# Altium schematic sheet MCU_CAN.SchDoc
size B; SheetNumber: 8; SheetTotal: 8
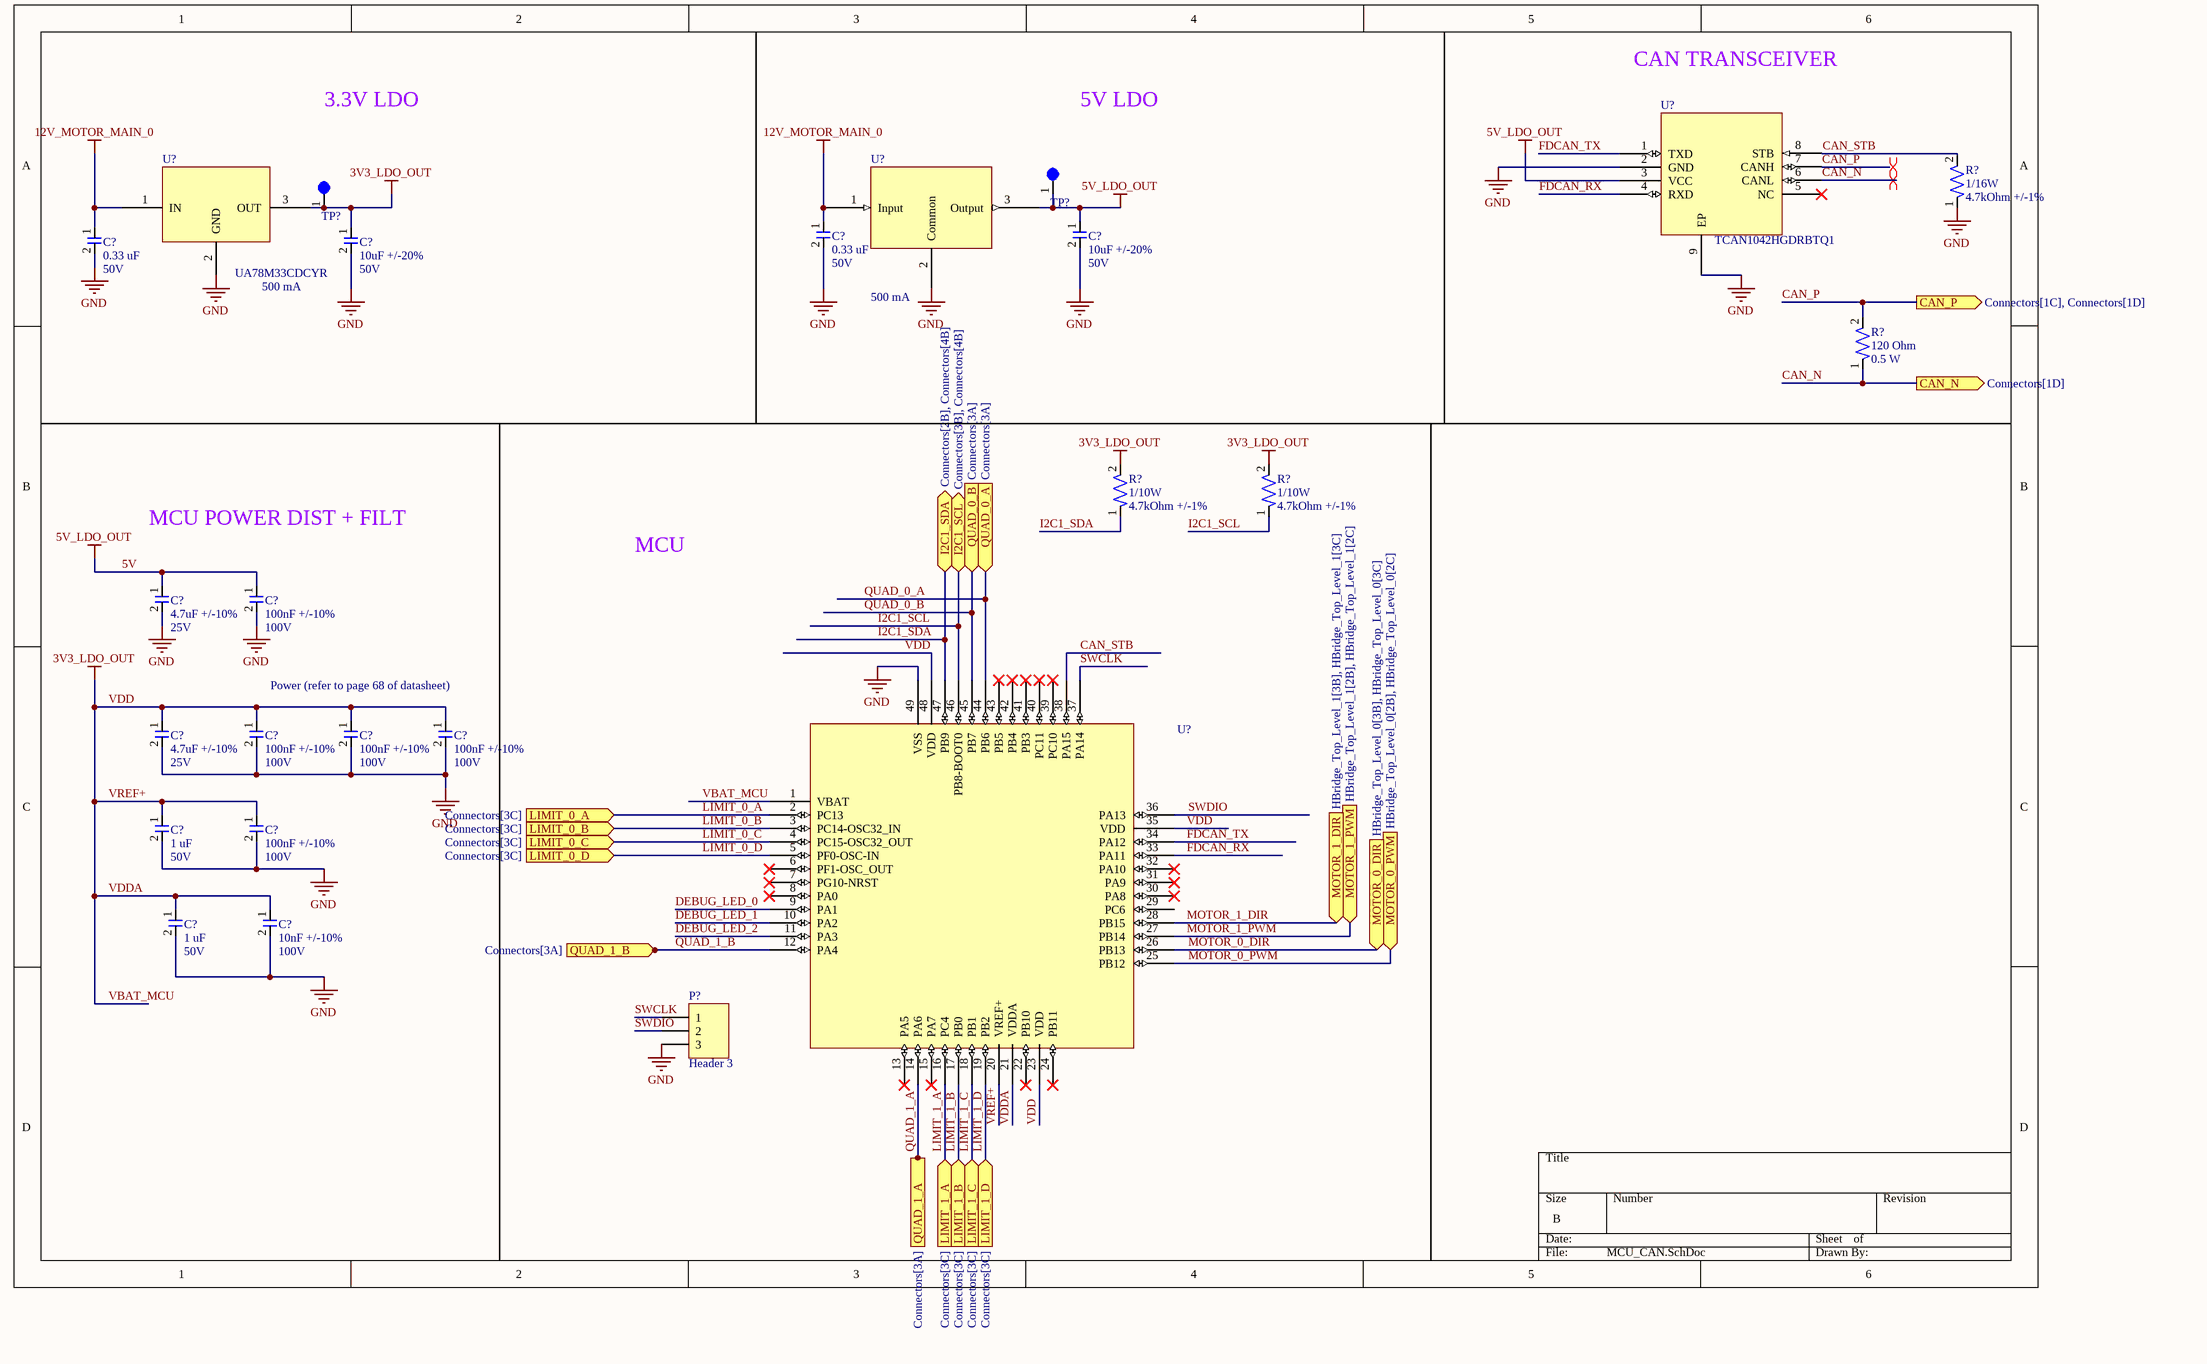
[diagram p0: MCU_CAN.SchDoc]

## Parts
(Parts that share a designator on the sheet are numbered #1, #2 ... from top to bottom, then left to right.)
C?#1  Capacitance: 0.33 uF  Voltage: 50V  [CAP-0603]  (hidden comment: CGA3E3X7R1H334K080AB)
C?#2  Capacitance: 10uF +/-20%  Voltage Rating: 50V  [CAP-1206]  (hidden comment: CL31B106KBHNNNE)
C?#3  Capacitance: 0.33 uF  Voltage: 50V  [CAP-0603]  (hidden comment: CGA3E3X7R1H334K080AB)
C?#4  Capacitance: 10uF +/-20%  Voltage Rating: 50V  [CAP-1206]  (hidden comment: CL31B106KBHNNNE)
C?#5  Capacitance: 4.7uF +/-10%  Voltage Rating: 25V  [CAP-0603]  (hidden comment: TMK107BBJ475KA-T)
C?#6  Capacitance: 100nF +/-10%  Voltage Rating: 100V  [CAP-0603]  (hidden comment: CC0603KRX7R0BB104)
C?#7  Capacitance: 4.7uF +/-10%  Voltage Rating: 25V  [CAP-0603]  (hidden comment: TMK107BBJ475KA-T)
C?#8  Capacitance: 100nF +/-10%  Voltage Rating: 100V  [CAP-0603]  (hidden comment: CC0603KRX7R0BB104)
C?#9  Capacitance: 100nF +/-10%  Voltage Rating: 100V  [CAP-0603]  (hidden comment: CC0603KRX7R0BB104)
C?#10  Capacitance: 100nF +/-10%  Voltage Rating: 100V  [CAP-0603]  (hidden comment: CC0603KRX7R0BB104)
C?#11  Capacitance: 1 uF  Voltage: 50V  [CAP-0603]  (hidden comment: UMK107AB7105KA-T)
C?#12  Capacitance: 100nF +/-10%  Voltage Rating: 100V  [CAP-0603]  (hidden comment: CC0603KRX7R0BB104)
C?#13  Capacitance: 1 uF  Voltage: 50V  [CAP-0603]  (hidden comment: UMK107AB7105KA-T)
C?#14  Capacitance: 10nF +/-10%  Voltage Rating: 100V  [CAP-0402]  (hidden comment: CC0402KRX7R0BB103)
P?  Header 3  [HDR1X3]
R?#1  Power Rating: 1/16W  Resistance: 4.7kOhm +/-1%  [RES-0402]  (hidden comment: RC0402FR-074K7P)
R?#2  Resistance: 120 Ohm  Power: 0.5 W  [RES-1206]  (hidden comment: CRGH1206F120R)
R?#3  Power Rating: 1/10W  Resistance: 4.7kOhm +/-1%  [RES-0603]  (hidden comment: AF0603FR-074K7L)
R?#4  Power Rating: 1/10W  Resistance: 4.7kOhm +/-1%  [RES-0603]  (hidden comment: AF0603FR-074K7L)
TP?#1  5003  [TEST-POINT-0001]  (value not drawn)
TP?#2  5003  [TEST-POINT-0001]  (value not drawn)
U?#1  TCAN1042HGDRBTQ1  [IC-8-VSON]
U?#2  UA78M33CDCYR  Current: 500 mA  [IC-SOT-223-4]
U?#3  Current: 500 mA  [IC-SOT-223-4]  (hidden comment: UA78M05IDCYR)
U?#4  STM32G431CBU6  [MCU-UFQFPN48]  (value not drawn)

## Ports
CAN_N (out, see Connectors[1D]), CAN_P (out, see Connectors[1C], Connectors[1D]), I2C1_SCL (bidir, see Connectors[3B], Connectors[4B]), I2C1_SDA (bidir, see Connectors[2B], Connectors[4B]), LIMIT_0_A (in, see Connectors[3C]), LIMIT_0_B (in, see Connectors[3C]), LIMIT_0_C (in, see Connectors[3C]), LIMIT_0_D (in, see Connectors[3C]), LIMIT_1_A (in, see Connectors[3C]), LIMIT_1_B (in, see Connectors[3C]), LIMIT_1_C (in, see Connectors[3C]), LIMIT_1_D (in, see Connectors[3C]), MOTOR_0_DIR (in, see HBridge_Top_Level_0[3B], HBridge_Top_Level_0[3C]), MOTOR_0_PWM (in, see HBridge_Top_Level_0[2B], HBridge_Top_Level_0[2C]), MOTOR_1_DIR (in, see HBridge_Top_Level_1[3B], HBridge_Top_Level_1[3C]), MOTOR_1_PWM (in, see HBridge_Top_Level_1[2B], HBridge_Top_Level_1[2C]), QUAD_0_A (in, see Connectors[3A]), QUAD_0_B (in, see Connectors[3A]), QUAD_1_A (in, see Connectors[3A]), QUAD_1_B (in, see Connectors[3A])

## Nets
5V: C?#2.1 C?#5.1 C?#6.1 TP?#1.1 U?#1.3(VCC) U?#3.3(Output)  [also labelled 5V_LDO_OUT]
12V_MOTOR_MAIN_0: C?#1.1 C?#3.1 U?#2.1(IN) U?#3.1(Input)
GND: C?#1.2 C?#2.2 C?#3.2 C?#4.2 C?#5.2 C?#6.2 C?#7.2 C?#8.2 C?#9.2 C?#10.2 C?#11.2 C?#12.2 C?#13.2 C?#14.2 P?.3 R?#1.1 U?#1.2(GND) U?#1.9(EP) U?#2.2(GND) U?#3.2(Common) U?#4.49(VSS)
VBAT_MCU: C?#4.1 C?#7.1 C?#8.1 C?#9.1 C?#10.1 C?#11.1 C?#12.1 C?#13.1 C?#14.1 R?#3.2 R?#4.2 TP?#2.1 U?#2.3(OUT) U?#4.1(VBAT) U?#4.20(VREF+) U?#4.21(VDDA) U?#4.23(VDD) U?#4.35(VDD) U?#4.48(VDD)  [also labelled 3V3_LDO_OUT, VDD, VDDA, VREF+]
CAN_N: R?#2.1 U?#1.6(CANL) ; port CAN_N
CAN_P: R?#2.2 U?#1.7(CANH) ; port CAN_P
CAN_STB: R?#1.2 U?#1.8(STB) U?#4.38(PA15)
DEBUG_LED_0: U?#4.9(PA1)
DEBUG_LED_1: U?#4.10(PA2)
DEBUG_LED_2: U?#4.11(PA3)
FDCAN_RX: U?#1.4(RXD) U?#4.33(PA11)
FDCAN_TX: U?#1.1(TXD) U?#4.34(PA12)
I2C1_SCL: R?#4.1 U?#4.46(PB8-BOOT0) ; port I2C1_SCL
I2C1_SDA: R?#3.1 U?#4.47(PB9) ; port I2C1_SDA
LIMIT_0_A: U?#4.2(PC13) ; port LIMIT_0_A
LIMIT_0_B: U?#4.3(PC14-OSC32_IN) ; port LIMIT_0_B
LIMIT_0_C: U?#4.4(PC15-OSC32_OUT) ; port LIMIT_0_C
LIMIT_0_D: U?#4.5(PF0-OSC-IN) ; port LIMIT_0_D
LIMIT_1_A: U?#4.16(PC4) ; port LIMIT_1_A
LIMIT_1_B: U?#4.17(PB0) ; port LIMIT_1_B
LIMIT_1_C: U?#4.18(PB1) ; port LIMIT_1_C
LIMIT_1_D: U?#4.19(PB2) ; port LIMIT_1_D
MOTOR_0_DIR: U?#4.26(PB13) ; port MOTOR_0_DIR
MOTOR_0_PWM: U?#4.25(PB12) ; port MOTOR_0_PWM
MOTOR_1_DIR: U?#4.28(PB15) ; port MOTOR_1_DIR
MOTOR_1_PWM: U?#4.27(PB14) ; port MOTOR_1_PWM
QUAD_0_A: U?#4.44(PB6) ; port QUAD_0_A
QUAD_0_B: U?#4.45(PB7) ; port QUAD_0_B
QUAD_1_A: U?#4.14(PA6) ; port QUAD_1_A
QUAD_1_B: U?#4.12(PA4) ; port QUAD_1_B
SWCLK: P?.1 U?#4.37(PA14)
SWDIO: P?.2 U?#4.36(PA13)

Not connected (* = marked no-connect by the designer): U?#1 5(NC)*; U?#4 6(PF1-OSC_OUT)* 7(PG10-NRST)* 8(PA0)* 13(PA5)* 15(PA7)* 22(PB10)* 24(PB11)* 29(PC6) 30(PA8)* 31(PA9)* 32(PA10)* 39(PC10)* 40(PC11)* 41(PB3)* 42(PB4)* 43(PB5)*

## Layout directives
differential pair: CAN_N, CAN_P

## Notes on the sheet
- CAN TRANSCEIVER
- 3.3V LDO
- 5V LDO
- MCU POWER DIST + FILT
- MCU
- (near C?#9) Power (refer to page 68 of datasheet)

## Library data of the parts
C?#1 C?#3 = CAP-0.33uF-0001: 0.33 µF ±10% 50V Ceramic Capacitor X7R 0603 (1608 Metric); Manufacturer: TDK Corporation; Tolerance: +/- 10%; Manufacturer Part Number: CGA3E3X7R1H334K080AB; Temperature Coefficient: X7R
C?#2 C?#4 = CAP-10U-0001: 10 µF ±10% 50V Ceramic Capacitor X7R 1206 (3216 Metric); Manufacturer: Samsung Electro-Mechanics; Assembled?: no; Manufacturer Part Number: CL31B106KBHNNNE; Temperature Coefficient: X7R; Package Size: 1206
C?#5 C?#7 = CAP-4.7U-0001: 4.7 µF ±10% 25V Ceramic Capacitor X5R 0603 (1608 Metric); Manufacturer: Taiyo Yuden; Assembled?: no; Manufacturer Part Number: TMK107BBJ475KA-T; Temperature Coefficient: X5R; Package Size: 0603
C?#6 C?#8-C?#10 C?#12 = CAP-100N-0001: CAP CER 0.1UF 100V X7R 0603; Manufacturer: YAGEO; Assembled?: no; Manufacturer Part Number: CC0603KRX7R0BB104; Temperature Coefficient: X7R; Package Size: 0603
C?#11 C?#13 = CAP-1U-0002: 1 µF ±10% 50V Ceramic Capacitor X7R 0603 (1608 Metric); Package Size: 0603
C?#14 = CAP-10N-0001: 10000 pF ±10% 100V Ceramic Capacitor X7R 0402 (1005 Metric); Manufacturer: YAGEO; Assembled?: no; Manufacturer Part Number: CC0402KRX7R0BB103; Temperature Coefficient: X7R; Package Size: 0402
P? = Header 3: Header, 3-Pin; LatestRevisionDate: 17-Jul-2002; LatestRevisionNote: Re-released for DXP Platform.; Publisher: Altium Limited
R?#1 = RES-4.7K-0001: RES SMD 4.7K OHM 1% 1/16W 0402; Manufacturer: YAGEO; Assembled?: no; Manufacturer Part Number: RC0402FR-074K7P; Package Size: 0402
R?#2 = RES-120-0002: 120 Ohms ±1% 0.5W, 1/2W Chip Resistor 1206 (3216 Metric) Thick Film; Tolerance: 1%; Package Size: 1206
R?#3 R?#4 = RES-4.7K-0002: RES SMD 4.7K OHM 1% 1/10W 0603; Manufacturer: YAGEO; Assembled?: no; Manufacturer Part Number: AF0603FR-074K7L; Package Size: 0603
TP?#1 TP?#2 = TEST-POINT-0001: Oranange PC Test Point, Miniature Phoisphor Bronze Silver Plating Through Hole Mounting Type
U?#1 = IC-CAN-TRANSCEIVER-0002: 1/1 Transceiver CANbus 8-VSON (3x3); Manufacturer: Texas Instrument; CAN Capability: FD-CAN; Manufacturer Part Number: TCAN1042HGDRBTQ1
U?#2 = IC-LDO-3.3V-0002: Linear Voltage Regulator IC Positive Fixed 1 Output 500mA SOT-223-4; Vin: 25V; Vout: 3.3V; Package: SOT-223-4
U?#3 = IC-LDO-5V-0003: Linear Voltage Regulator IC Positive Fixed 1 Output 500mA SOT-223-4; Manufacturer: Texas Instruments; Assembled?: no; Manufacturer Part Number: UA78M05IDCYR; Package Size: SOT223-4; Type: Low dropout (LDO)
U?#4 = IC-STM32G431CBU6: 128KB 1.71V~3.6V ARM-MSeries 32KB 170MHz FLASH 42 UFQFPN-48(7x7) Microcontroller Units (MCUs/MPUs/SOCs) ROHS; Assembled?: no; Manufacturer Part Number: STM32G431CBU6; Package: UFQFPN-48